# Altium schematic sheet Top.SchDoc
size A4
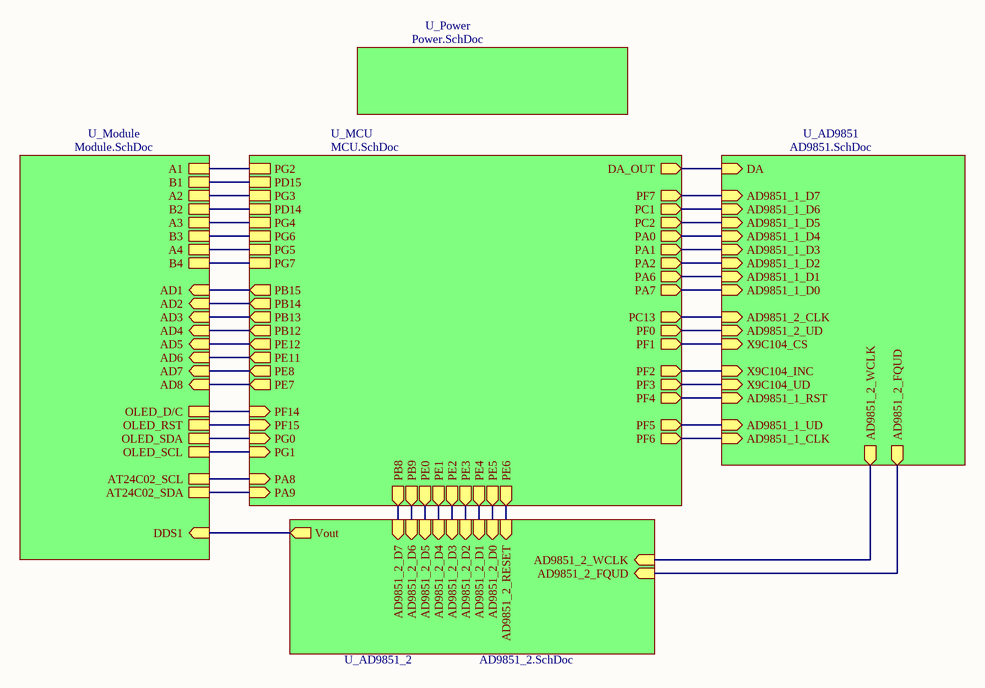
[diagram p0: Top.SchDoc]

## Sub-sheets
U_AD9851 = AD9851.SchDoc: DA (in), AD9851_1_D7 (in), AD9851_1_D6 (in), AD9851_1_D5 (in), AD9851_1_D3 (in), AD9851_1_D2 (in), AD9851_1_D1 (in), AD9851_1_D0 (in), AD9851_1_D4 (in), AD9851_1_CLK (in), AD9851_1_RST (in), AD9851_1_UD (in), X9C104_INC (in), X9C104_UD (in), X9C104_CS (in), AD9851_2_CLK (in), AD9851_2_UD (in), AD9851_2_WCLK (out), AD9851_2_FQUD (out)
U_AD9851_2 = AD9851_2.SchDoc: AD9851_2_D7 (in), AD9851_2_D6 (in), AD9851_2_D5 (in), AD9851_2_D3 (in), AD9851_2_D2 (in), AD9851_2_D1 (in), AD9851_2_D0 (in), AD9851_2_D4 (in), AD9851_2_WCLK (in), AD9851_2_FQUD (in), Vout (out), AD9851_2_RESET (in)
U_MCU = MCU.SchDoc: PF0 (out), PF1 (out), PF2 (out), PF3 (out), PF4 (out), PF5 (out), PF6 (out), PF7 (out), PG3, PG4, PG2, PG5, PD15, PD14, PG6, PG7, PE8 (out), PE7 (out), PG1, PG0, PF15, PF14, PE12 (out), PE11 (out), PB9 (out), PE0 (out), PE2 (out), PE3 (out), PE4 (out), PE5 (out), PE6 (out), PC13 (out), PA0 (out), PA1 (out), PA2 (out), DA_OUT (out), PC1 (out), PC2 (out), PE1 (out), PB8 (out), PA6 (out), PA7 (out), PB14 (out), PB13 (out), PB12 (out), PB15 (out), PA8, PA9
U_Module = Module.SchDoc: AT24C02_SCL, AT24C02_SDA, A1, B1, A2, B2, A3, B3, A4, B4, OLED_D/C, OLED_RST, OLED_SDA, OLED_SCL, AD4 (in), AD3 (in), AD8 (in), AD7 (in), AD6 (in), AD2 (in), AD5 (in), AD1 (in), DDS1 (in)
U_Power = Power.SchDoc: no entries

## Nets
(unnamed): sheet U_MCU/PF0, sheet U_AD9851/AD9851_2_UD
(unnamed): sheet U_MCU/PF1, sheet U_AD9851/X9C104_CS
(unnamed): sheet U_MCU/PF2, sheet U_AD9851/X9C104_INC
(unnamed): sheet U_MCU/PF3, sheet U_AD9851/X9C104_UD
(unnamed): sheet U_MCU/PF4, sheet U_AD9851/AD9851_1_RST
(unnamed): sheet U_MCU/PF5, sheet U_AD9851/AD9851_1_UD
(unnamed): sheet U_MCU/PF6, sheet U_AD9851/AD9851_1_CLK
(unnamed): sheet U_MCU/PF7, sheet U_AD9851/AD9851_1_D7
(unnamed): sheet U_MCU/PG3, sheet U_Module/A2
(unnamed): sheet U_MCU/PG4, sheet U_Module/A3
(unnamed): sheet U_MCU/PG2, sheet U_Module/A1
(unnamed): sheet U_MCU/PG5, sheet U_Module/A4
(unnamed): sheet U_MCU/PD15, sheet U_Module/B1
(unnamed): sheet U_MCU/PD14, sheet U_Module/B2
(unnamed): sheet U_MCU/PG6, sheet U_Module/B3
(unnamed): sheet U_MCU/PG7, sheet U_Module/B4
(unnamed): sheet U_MCU/PE8, sheet U_Module/AD7
(unnamed): sheet U_MCU/PE7, sheet U_Module/AD8
(unnamed): sheet U_MCU/PG1, sheet U_Module/OLED_SCL
(unnamed): sheet U_MCU/PG0, sheet U_Module/OLED_SDA
(unnamed): sheet U_MCU/PF15, sheet U_Module/OLED_RST
(unnamed): sheet U_MCU/PF14, sheet U_Module/OLED_D/C
(unnamed): sheet U_MCU/PE12, sheet U_Module/AD5
(unnamed): sheet U_MCU/PE11, sheet U_Module/AD6
(unnamed): sheet U_MCU/PB9, sheet U_AD9851_2/AD9851_2_D6
(unnamed): sheet U_MCU/PE0, sheet U_AD9851_2/AD9851_2_D5
(unnamed): sheet U_MCU/PE2, sheet U_AD9851_2/AD9851_2_D3
(unnamed): sheet U_MCU/PE3, sheet U_AD9851_2/AD9851_2_D2
(unnamed): sheet U_MCU/PE4, sheet U_AD9851_2/AD9851_2_D1
(unnamed): sheet U_MCU/PE5, sheet U_AD9851_2/AD9851_2_D0
(unnamed): sheet U_MCU/PE6, sheet U_AD9851_2/AD9851_2_RESET
(unnamed): sheet U_MCU/PC13, sheet U_AD9851/AD9851_2_CLK
(unnamed): sheet U_MCU/PA0, sheet U_AD9851/AD9851_1_D4
(unnamed): sheet U_MCU/PA1, sheet U_AD9851/AD9851_1_D3
(unnamed): sheet U_MCU/PA2, sheet U_AD9851/AD9851_1_D2
(unnamed): sheet U_MCU/DA_OUT, sheet U_AD9851/DA
(unnamed): sheet U_MCU/PC1, sheet U_AD9851/AD9851_1_D6
(unnamed): sheet U_MCU/PC2, sheet U_AD9851/AD9851_1_D5
(unnamed): sheet U_MCU/PE1, sheet U_AD9851_2/AD9851_2_D4
(unnamed): sheet U_MCU/PB8, sheet U_AD9851_2/AD9851_2_D7
(unnamed): sheet U_MCU/PA6, sheet U_AD9851/AD9851_1_D1
(unnamed): sheet U_MCU/PA7, sheet U_AD9851/AD9851_1_D0
(unnamed): sheet U_MCU/PB14, sheet U_Module/AD2
(unnamed): sheet U_MCU/PB13, sheet U_Module/AD3
(unnamed): sheet U_MCU/PB12, sheet U_Module/AD4
(unnamed): sheet U_MCU/PB15, sheet U_Module/AD1
(unnamed): sheet U_MCU/PA8, sheet U_Module/AT24C02_SCL
(unnamed): sheet U_MCU/PA9, sheet U_Module/AT24C02_SDA
(unnamed): sheet U_AD9851/AD9851_2_WCLK, sheet U_AD9851_2/AD9851_2_WCLK
(unnamed): sheet U_AD9851/AD9851_2_FQUD, sheet U_AD9851_2/AD9851_2_FQUD
(unnamed): sheet U_AD9851_2/Vout, sheet U_Module/DDS1